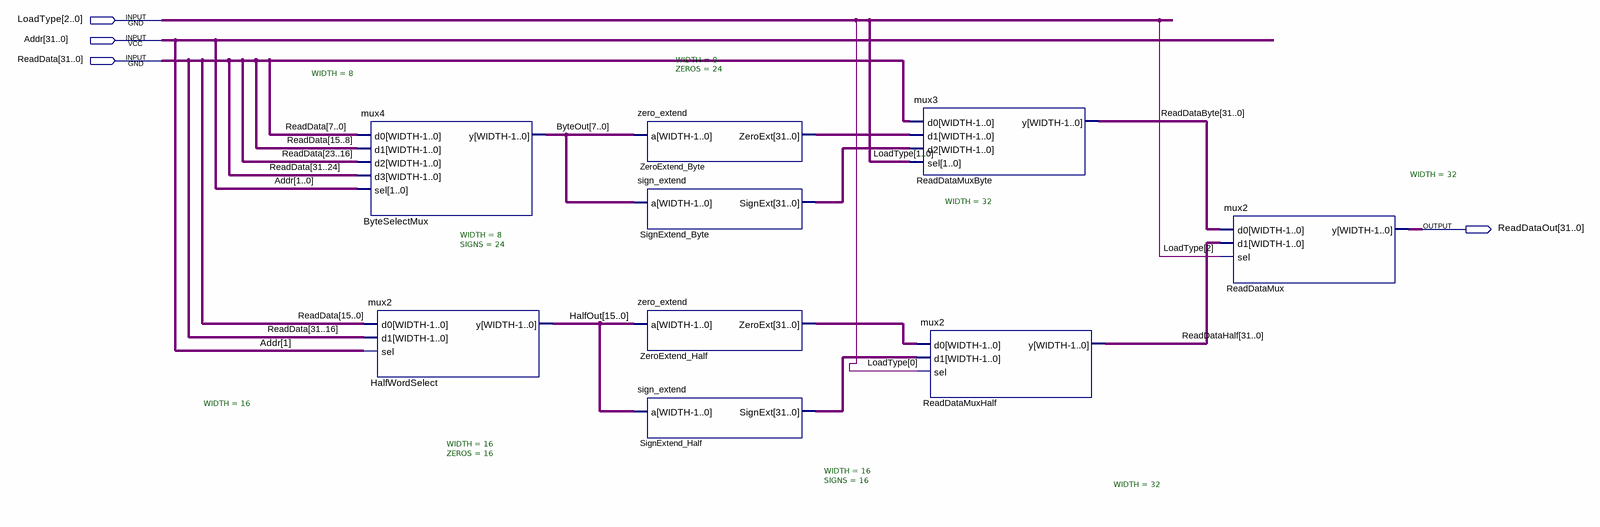
[diagram p0: schematic sheet]
// Quartus schematic read_data.bdf as structural Verilog: 9 symbols, 4 pins
module read_data (
  input  [2:0] LoadType,
  input  [31:0] Addr,
  input  [31:0] ReadData,
  output [31:0] ReadDataOut
);

  wire [7:0] ByteOut;
  wire [15:0] HalfOut;
  wire [31:0] ReadDataByte, ReadDataHalf, SignExtend_Byte_signext, SignExtend_Half_signext,
       ZeroExtend_Byte_zeroext, ZeroExtend_Half_zeroext;

  mux4 #(.WIDTH(8)) ByteSelectMux (
    .d0(ReadData[7:0]), .d1(ReadData[15:8]), .d2(ReadData[23:16]), .d3(ReadData[31:24]), .sel(Addr[1:0]),
    .y(ByteOut));
  mux2 #(.WIDTH(16)) HalfWordSelect (.d0(ReadData[15:0]), .d1(ReadData[31:16]), .sel(Addr[1]), .y(HalfOut));
  zero_extend #(.WIDTH(8), .ZEROS(24)) ZeroExtend_Byte (.a(ByteOut), .ZeroExt(ZeroExtend_Byte_zeroext));
  sign_extend #(.WIDTH(8), .SIGNS(24)) SignExtend_Byte (.a(ByteOut), .SignExt(SignExtend_Byte_signext));
  zero_extend #(.WIDTH(16), .ZEROS(16)) ZeroExtend_Half (.a(HalfOut), .ZeroExt(ZeroExtend_Half_zeroext));
  sign_extend #(.WIDTH(16), .SIGNS(16)) SignExtend_Half (.a(HalfOut), .SignExt(SignExtend_Half_signext));
  mux3 #(.WIDTH(32)) ReadDataMuxByte (
    .d0(ReadData), .d1(ZeroExtend_Byte_zeroext), .d2(SignExtend_Byte_signext), .sel(LoadType[1:0]),
    .y(ReadDataByte));
  mux2 #(.WIDTH(32)) ReadDataMuxHalf (
    .d0(ZeroExtend_Half_zeroext), .d1(SignExtend_Half_signext), .sel(LoadType[0]), .y(ReadDataHalf));
  mux2 #(.WIDTH(32)) ReadDataMux (.d0(ReadDataByte), .d1(ReadDataHalf), .sel(LoadType[2]), .y(ReadDataOut));
endmodule
